# Altium project DM2080.PrjPcb (part 6 of 6)
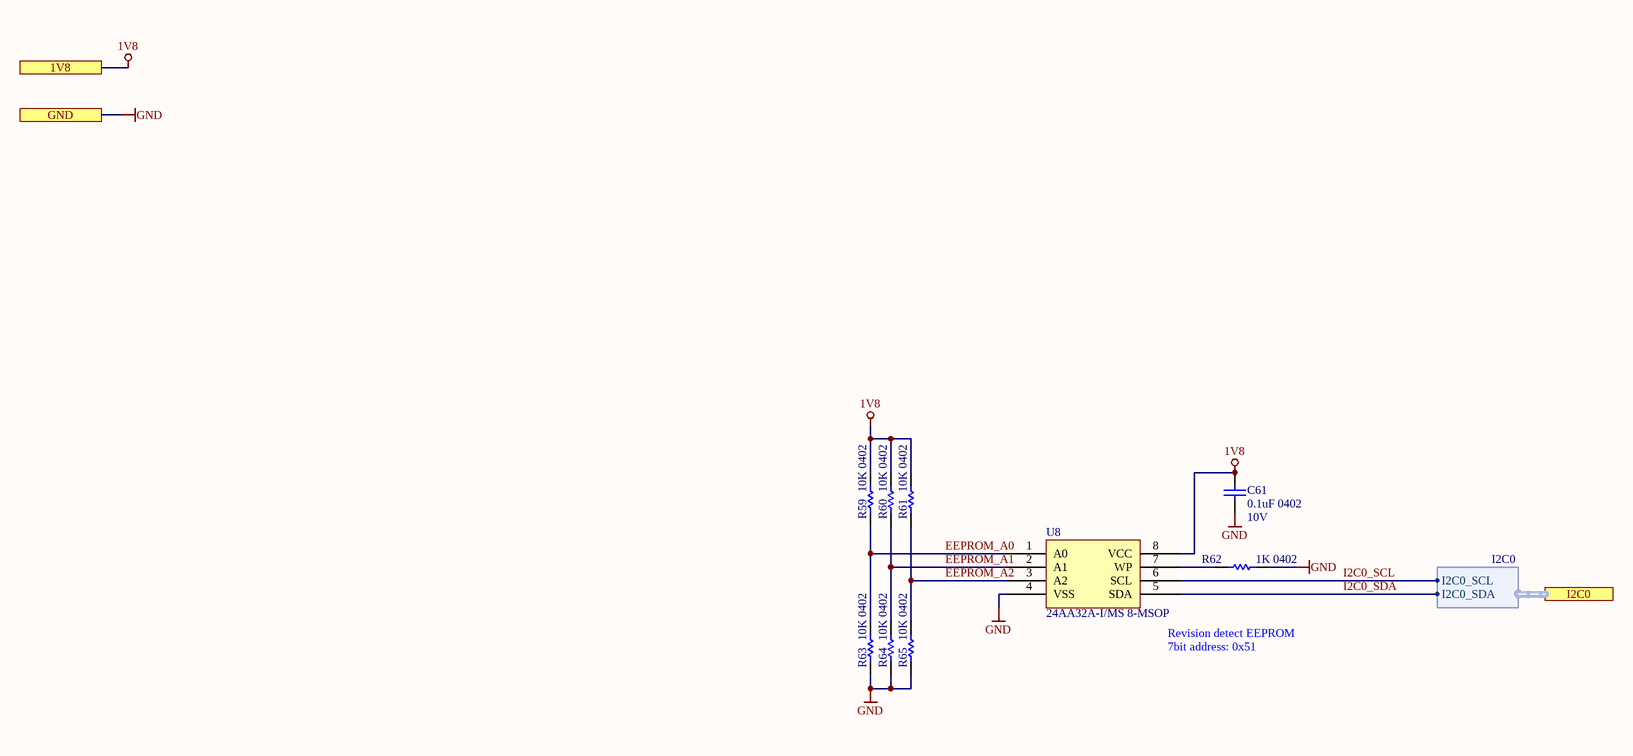
[diagram p10: DM2080_EEPROM.SchDoc]

## Nets that join several sheets
1V2: DM2080_LEFT_OV9782 (FB2.1), DM2080_Power_Supply (6 pins), DM2080_RIGHT_OV9782 (FB4.1)
1V8: DM2080_BMI270 (C2.2 U1.5), DM2080_Connector_B (9 pins), DM2080_LEFT_OV9782 (FB1.1), DM2080_Power_Supply (C16.2 R33.2 TP7.1 U3.10), DM2080_RIGHT_OV9782 (FB3.1), DM2080_USB (R44.2 R47.2 R49.2 R50.2), DM2080_EEPROM (5 pins)
2V8: DM2080_LEFT_OV9782 (R25.1), DM2080_Power_Supply (C18.2 R35.2 TP14.1 U3.8), DM2080_RIGHT_OV9782 (R37.1)
3V3: DM2080_BMI270 (C1.2 U1.8), DM2080_Power_Supply (C20.2 TP8.1 U4.1), DM2080_USB (7 pins)
5V: DM2080_Connector_A (D1.1 R53.1), DM2080_Connector_B (8 pins), DM2080_Power_Supply (17 pins), DM2080_USB (C31.1 C40.2 U6.12)
GND: DM2080_BMI270 (C1.1 C2.1 U1.6 U1.7), DM2080_Connector_A (41 pins), DM2080_Connector_B (37 pins), DM2080_LEFT_OV9782 (19 pins), DM2080_Power_Supply (27 pins), DM2080_RIGHT_OV9782 (19 pins), DM2080_USB (25 pins), DM2080_EEPROM (6 pins)
VBUS: DM2080_Connector_B (J2.80), DM2080_Power_Supply (R29.1 R66.1 TP4.1), DM2080_USB (11 pins)
BMI270_CS_1V8: DM2080_BMI270 (U1.12), DM2080_Connector_A (J1.60)
BMI270_MISO_1V8: DM2080_BMI270 (U1.1), DM2080_Connector_A (J1.64)
BMI270_MOSI_1V8: DM2080_BMI270 (U1.14), DM2080_Connector_A (J1.62)
BMI270_SCK_1V8: DM2080_BMI270 (U1.13), DM2080_Connector_A (J1.66)
CAMA_CLK: DM2080_Connector_A (J1.28), DM2080_LEFT_OV9782 (J4.3)
CAMA_PWR: DM2080_Connector_A (J1.34), DM2080_LEFT_OV9782 (J4.9 R28.1)
CAMD_CLK: DM2080_Connector_B (J2.42), DM2080_RIGHT_OV9782 (J5.3)
CAMD_PWR: DM2080_Connector_B (J2.54), DM2080_RIGHT_OV9782 (J5.9 R40.1)
COM_AUX_IO2: DM2080_Connector_A (R7.1), DM2080_LEFT_OV9782 (R5.2 R6.2)
FSIN_R: DM2080_LEFT_OV9782 (R6.1), DM2080_RIGHT_OV9782 (J5.8)
I2C0_SCL: DM2080_Connector_B (J2.34), DM2080_EEPROM (U8.6)
I2C0_SDA: DM2080_Connector_B (J2.36), DM2080_EEPROM (U8.5)
I2C1_SCL: DM2080_Connector_A (J1.35), DM2080_LEFT_OV9782 (J4.7)
I2C1_SDA: DM2080_Connector_A (J1.33), DM2080_LEFT_OV9782 (J4.5)
I2C2_SCL: DM2080_Connector_A (J1.77), DM2080_RIGHT_OV9782 (J5.7)
I2C2_SDA: DM2080_Connector_A (J1.79), DM2080_RIGHT_OV9782 (J5.5)
IMU_INT_1V8: DM2080_BMI270 (U1.4), DM2080_Connector_B (J2.17 TP16.1)
IMU_WAKE_1V8: DM2080_BMI270 (U1.9), DM2080_Connector_B (J2.23 TP21.1)
MIPI_RX4_C_N: DM2080_Connector_A (J1.3), DM2080_LEFT_OV9782 (J4.20)
MIPI_RX4_C_P: DM2080_Connector_A (J1.5), DM2080_LEFT_OV9782 (J4.19)
MIPI_RX4_D0_N: DM2080_Connector_A (J1.9), DM2080_LEFT_OV9782 (J4.26)
MIPI_RX4_D0_P: DM2080_Connector_A (J1.11), DM2080_LEFT_OV9782 (J4.25)
MIPI_RX4_D1_N: DM2080_Connector_A (J1.15), DM2080_LEFT_OV9782 (J4.22)
MIPI_RX4_D1_P: DM2080_Connector_A (J1.17), DM2080_LEFT_OV9782 (J4.23)
MIPI_RX5_D0_N: DM2080_Connector_A (J1.21), DM2080_LEFT_OV9782 (J4.16)
MIPI_RX5_D0_P: DM2080_Connector_A (J1.23), DM2080_LEFT_OV9782 (J4.17)
MIPI_RX5_D1_N: DM2080_Connector_A (J1.27), DM2080_LEFT_OV9782 (J4.14)
MIPI_RX5_D1_P: DM2080_Connector_A (J1.29), DM2080_LEFT_OV9782 (J4.13)
MIPI_RX6_C_N: DM2080_Connector_A (J1.4), DM2080_RIGHT_OV9782 (J5.20)
MIPI_RX6_C_P: DM2080_Connector_A (J1.6), DM2080_RIGHT_OV9782 (J5.19)
MIPI_RX6_D0_N: DM2080_Connector_A (J1.10), DM2080_RIGHT_OV9782 (J5.26)
MIPI_RX6_D0_P: DM2080_Connector_A (J1.12), DM2080_RIGHT_OV9782 (J5.25)
MIPI_RX6_D1_N: DM2080_Connector_A (J1.16), DM2080_RIGHT_OV9782 (J5.22)
MIPI_RX6_D1_P: DM2080_Connector_A (J1.18), DM2080_RIGHT_OV9782 (J5.23)
MIPI_RX7_D0_N: DM2080_Connector_A (J1.22), DM2080_RIGHT_OV9782 (J5.16)
MIPI_RX7_D0_P: DM2080_Connector_A (J1.24), DM2080_RIGHT_OV9782 (J5.17)
MIPI_RX7_D1_N: DM2080_Connector_A (J1.46), DM2080_RIGHT_OV9782 (J5.14)
MIPI_RX7_D1_P: DM2080_Connector_A (J1.48), DM2080_RIGHT_OV9782 (J5.13)
USB_D_N: DM2080_Connector_B (J2.90), DM2080_USB (J6.A7 J6.B7)
USB_D_P: DM2080_Connector_B (J2.92), DM2080_USB (J6.A6 J6.B6)
USB_ID: DM2080_Connector_B (J2.66), DM2080_USB (R47.1 U6.9)
USB_OUT1: DM2080_Connector_B (J2.60), DM2080_USB (R49.1 TP19.1 U6.7)
USB_OUT2: DM2080_Connector_B (J2.62), DM2080_USB (R50.1 TP18.1 U6.8)
USB_OUT3: DM2080_Connector_B (J2.64), DM2080_USB (R44.1 U6.6)
USB_RX_N: DM2080_Connector_B (J2.96), DM2080_USB (U5.4)
USB_RX_P: DM2080_Connector_B (J2.98), DM2080_USB (U5.3)
USB_TX_N: DM2080_Connector_B (J2.84), DM2080_USB (U5.8)
USB_TX_P: DM2080_Connector_B (J2.86), DM2080_USB (U5.7)

## Assembly variants
Production: not fitted J3 R8 R11 R12 R13 R16 R18 R19 R60 R61 R63